# Altium project SMALL_BCMV1.0.PrjPcb (part 3 of 3)

## Sheet DISCRETE_OUT.SchDoc
size A4; SheetNumber: 12; SheetTotal: 13
Used 2 times, as channels U_DISCRETE_OUT1, U_DISCRETE_OUT2. Parts and nets are listed once, with the designators drawn on the sheet.
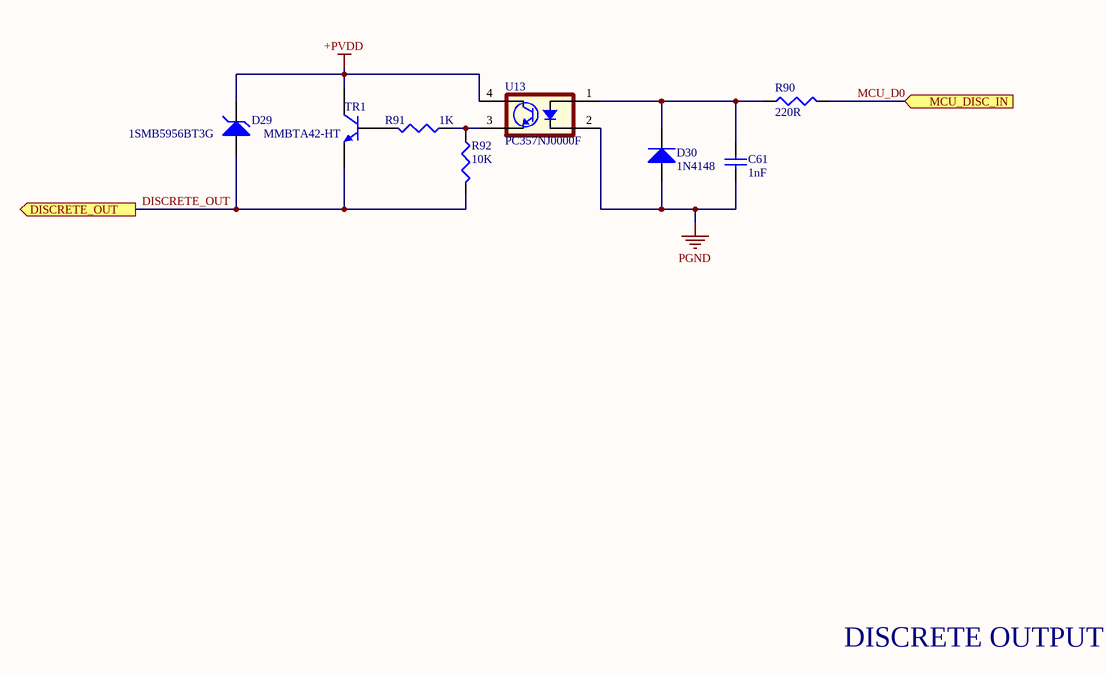
[diagram p16: DISCRETE_OUT.SchDoc]

### Parts
C61  1nF  [C 0603(1608)x0.8_3]
D29  value 1SMB5956BT3G  [DO214AA]  (hidden comment: DIODE 1SMB5956BT3G ZENER 200V 3W DO214AA)
D30  value 1N4148  [SOD123]  (hidden comment: DIODE 1N4148 GEN PURP 100V 150MA SOD123)
R90  220R  [R 0603(1608)]
R91  1K  [R 0603(1608)]
R92  10K  [R 0603(1608)]
TR1  MMBTA42-HT  [SOT23-3]
U13  PC357NJ0000F  [SOIC_1TJ00F_SHP]

### Ports
DISCRETE_OUT (out), MCU_DISC_IN (in)

### Nets
+PVDD: D29.2(K) TR1.3(C) U13.4
PGND: C61.2 D30.1(A) U13.2
DISCRETE_OUT: D29.1(A) R92.2 TR1.2(E) ; port DISCRETE_OUT
MCU_D0: R90.2 ; port MCU_DISC_IN
NetC61_1: C61.1 D30.2(K) R90.1 U13.1
NetR91_1: R91.1 R92.1 U13.3
NetR91_2: R91.2 TR1.1(B)

### Channels
U_DISCRETE_OUT1: designators end in A; ports DISCRETE_OUT=DISCRETE_OUT MCU_DISC_IN=MCU_D0
U_DISCRETE_OUT2: designators end in B; ports DISCRETE_OUT=DISCRETE_OUT MCU_DISC_IN=MCU_D0

### Notes on the sheet
- DISCRETE OUTPUT

### Library data of the parts
C61 = Cap: Cap Ceramic 0.001uF 50V X7R 10% SMD 0603 125C Paper T/R; Manufacturer: Murata; Manufacturer Part Number: GCM188R71H102KA37D; ComponentLink1URL: https://datasheet.ciiva.com/18102/getdatasheetpartid-85307-18102905.pdf?src-supplier=Verical; ComponentLink1Description: https://datasheet.ciiva.com/18102/getdatasheetpartid-85307-18102905.pdf?src-supplier=Verical; ComponentLink2URL: https://datasheet.ciiva.com/129/grm155r71c104ka88-01-129739.pdf?src-supplier=Digi-Key; ComponentLink2Description: https://datasheet.ciiva.com/129/grm155r71c104ka88-01-129739.pdf?src-supplier=Digi-Key; ComponentLink3URL: https://datasheet.ciiva.com/129/grm155r71c104ka88-01-129740.pdf?src-supplier=Digi-Key; ComponentLink3Description: https://datasheet.ciiva.com/129/grm155r71c104ka88-01-129740.pdf?src-supplier=Digi-Key; ComponentLink4URL: https://datasheet.ciiva.com/29199/454098-da-01-en-vs-kondensator-0402-29199799.pdf?src-supplier=Conrad; ComponentLink4Description: https://datasheet.ciiva.com/29199/454098-da-01-en-vs-kondensator-0402-29199799.pdf?src-supplier=Conrad; ComponentLink5URL: https://datasheet.ciiva.com/28534/4360-28534133.pdf?src-supplier=Element14; ComponentLink5Description: https://datasheet.ciiva.com/28534/4360-28534133.pdf?src-supplier=Element14; ComponentLink6URL: https://datasheet.ciiva.com/14103/grmseries-highdielectrictype-eng-14103750.pdf?src-supplier=Distrelec; ComponentLink6Description: https://datasheet.ciiva.com/14103/grmseries-highdielectrictype-eng-14103750.pdf?src-supplier=Distrelec; ComponentLink7URL: https://datasheet.ciiva.com/16199/product-16199000.pdf?src-supplier=Future+Electronics; ComponentLink7Description: https://datasheet.ciiva.com/16199/product-16199000.pdf?src-supplier=Future+Electronics; ComponentLink8URL: https://datasheet.ciiva.com/14116/grmseries-highdielectrictype-eng-14116878.pdf?src-supplier=Distrelec; ComponentLink8Description: https://datasheet.ciiva.com/14116/grmseries-highdielectrictype-eng-14116878.pdf?src-supplier=Distrelec; ComponentLink9URL: https://datasheet.ciiva.com/7937/4360-7937615.pdf?src-supplier=Element14; ComponentLink9Description: https://datasheet.ciiva.com/7937/4360-7937615.pdf?src-supplier=Element14; ComponentLink10URL: https://datasheet.ciiva.com/28534/4360-28534127.pdf?src-supplier=Element14; ComponentLink10Description: https://datasheet.ciiva.com/28534/4360-28534127.pdf?src-supplier=Element14; ComponentLink11URL: http://www.farnell.com/datasheets/2079151.pdf?src-supplier=Farnell; ComponentLink11Description: http://www.farnell.com/datasheets/2079151.pdf?src-supplier=Farnell; ComponentLink12URL: http://www.mouser.com/ds/2/281/c02e-2905.pdf?src-supplier=Mouser; ComponentLink12Description: http://www.mouser.com/ds/2/281/c02e-2905.pdf?src-supplier=Mouser; ComponentLink13URL: http://search.murata.co.jp/Ceramy/image/img/A01X/G101/ENG/GRM155R62A104KE14-01.pdf?src-supplier=Digi-Key; ComponentLink13Description: http://search.murata.co.jp/Ceramy/image/img/A01X/G101/ENG/GRM155R62A104KE14-01.pdf?src-supplier=Digi-Key; ComponentLink14URL: http://www.farnell.com/datasheets/2079151.pdf?src-supplier=Newark; ComponentLink14Description: http://www.farnell.com/datasheets/2079151.pdf?src-supplier=Newark; ComponentLink15URL: http://www.farnell.com/datasheets/2079151.pdf?src-supplier=Element14; ComponentLink15Description: http://www.farnell.com/datasheets/2079151.pdf?src-supplier=Element14; ComponentLink16URL: https://datasheet.ciiva.com/11786/0900766b80d84f1d-11786061.pdf?src-supplier=RSComponents; ComponentLink16Description: https://datasheet.ciiva.com/11786/0900766b80d84f1d-11786061.pdf?src-supplier=RSComponents; ComponentLink17URL: https://datasheet.ciiva.com/144/mlccorderingcode-144176.pdf?src-supplier=Digi-Key; ComponentLink17Description: https://datasheet.ciiva.com/144/mlccorderingcode-144176.pdf?src-supplier=Digi-Key; ComponentLink18URL: https://datasheet.ciiva.com/144/mlccorderingcode-144177.pdf?src-supplier=Digi-Key; ComponentLink18Description: https://datasheet.ciiva.com/144/mlccorderingcode-144177.pdf?src-supplier=Digi-Key; ComponentLink19URL: https://datasheet.ciiva.com/144/mlccorderingcode-144178.pdf?src-supplier=Digi-Key; ComponentLink19Description: https://datasheet.ciiva.com/144/mlccorderingcode-144178.pdf?src-supplier=Digi-Key; ComponentLink20URL: https://datasheet.ciiva.com/7978/1489800-7978166.pdf?src-supplier=Element14; ComponentLink20Description: https://datasheet.ciiva.com/7978/1489800-7978166.pdf?src-supplier=Element14; ComponentLink21URL: https://datasheet.ciiva.com/16625/upy-gphc-x7r-6-3v-to-50v-8-16625530.pdf?src-supplier=Avnet+Europe; ComponentLink21Description: https://datasheet.ciiva.com/16625/upy-gphc-x7r-6-3v-to-50v-8-16625530.pdf?src-supplier=Avnet+Europe; ComponentLink22URL: https://datasheet.ciiva.com/8033/70765-8033819.pdf?src-supplier=Element14; ComponentLink22Description: https://datasheet.ciiva.com/8033/70765-8033819.pdf?src-supplier=Element14; ComponentLink23URL: https://datasheet.ciiva.com/8033/70765-8033821.pdf?src-supplier=Element14; ComponentLink23Description: https://datasheet.ciiva.com/8033/70765-8033821.pdf?src-supplier=Element14; ComponentLink24URL: https://datasheet.ciiva.com/22749/1489800-22749214.pdf?src-supplier=Element14; ComponentLink24Description: https://datasheet.ciiva.com/22749/1489800-22749214.pdf?src-supplier=Element14; ComponentLink25URL: https://datasheet.ciiva.com/31394/1489800-31394927.pdf?src-supplier=Farnell; ComponentLink25Description: https://datasheet.ciiva.com/31394/1489800-31394927.pdf?src-supplier=Farnell; Supplier 1: Digi-Key; Supplier Part Number 1: 490-4777-1-ND; RoHS: Yes; Category: Ceramic Capacitors; Stock 1: 11039468; Pricing 1: 1=0,10000, 10=0,07100, 50=0,03900, 100=0,03180, 500=0,02272, 1000=0,01785 (USD); Mount: Surface Mount; Case/Package: 0603; Case Code (Imperial): 0603; Case Code (Metric): 1608; Min Operating Temperature: -55°C; Max Operating Temperature: 125°C; Capacitance: 1nF; Tolerance: 10%; Dielectric: X7R; Packaging: Tape and Reel; Voltage Rating: 50V; Voltage Rating (DC): 50V; Package Quantity: 4000; Termination: SMD/SMT; Voltage: 50V; Series: GCM; Construction: Flat; Length: 1.6mm; Width: 0.8mm; Height: 0.8mm; Thickness: 0.035inch; Depth: 0.8mm; Ratings: AEC-Q200; Radiation Hardening: No; REACH SVHC: No SVHC; Lead Free: Lead Free; RoHS Compliant: Yes; ComponentLink26URL: https://datasheet.ciiva.com/18183/getdatasheetpartid-310250-18183617.pdf?src-supplier=Verical; ComponentLink26Description: https://datasheet.ciiva.com/18183/getdatasheetpartid-310250-18183617.pdf?src-supplier=Verical; ComponentLink27URL: https://datasheet.ciiva.com/11787/0900766b80ef92d0-11787654.pdf?src-supplier=RSComponents; ComponentLink27Description: https://datasheet.ciiva.com/11787/0900766b80ef92d0-11787654.pdf?src-supplier=RSComponents; ComponentLink28URL: https://datasheet.ciiva.com/131/product-131993.pdf?src-supplier=Digi-Key; ComponentLink28Description: https://datasheet.ciiva.com/131/product-131993.pdf?src-supplier=Digi-Key; ComponentLink29URL: https://datasheet.ciiva.com/131/product-131994.pdf?src-supplier=Digi-Key; ComponentLink29Description: https://datasheet.ciiva.com/131/product-131994.pdf?src-supplier=Digi-Key; ComponentLink30URL: https://datasheet.ciiva.com/131/product-131995.pdf?src-supplier=Digi-Key; ComponentLink30Description: https://datasheet.ciiva.com/131/product-131995.pdf?src-supplier=Digi-Key; ComponentLink31URL: https://datasheet.ciiva.com/11621/product-11621654.pdf?src-supplier=Avnet; ComponentLink31Description: https://datasheet.ciiva.com/11621/product-11621654.pdf?src-supplier=Avnet; ComponentLink32URL: https://datasheet.ciiva.com/16624/product-16624559.pdf?src-supplier=Avnet+Europe; ComponentLink32Description: https://datasheet.ciiva.com/16624/product-16624559.pdf?src-supplier=Avnet+Europe
D29 = DIODE 1SMB5956BT3G ZENER 200V 3W DO214AA: Manufacturer: ON SEMI; Code: 3040095; Family: DIODE; Manufacturer Part Name: 1SMB5956BT3G; Package Reference: DO35; Supplier: Farnell; Supplier No: 2440703
D30 = DIODE 1N4148 GEN PURP 100V 150MA SOD123: Manufacturer: MICRO COMMERCIAL; Manufacturer Part Name: 1N4148W-TP; Code: 3040007; Family: DIODE; Package Reference: SOD123; Supplier: Digikey; Supplier No: 1N4148WTPMSTR-ND
R90 = Res3: THICK FILM RESISTOR, 220 OHM, 100mW, 1%; Product Range:RC Series; Resistance:220ohm; Power Rating:100mW; Resistance Tolerance: 1%; Voltage Rating:50V; Resistor Case Style:0603 [1608 Metric]; Packaging:Cut Tape; MSL:-; No. of Pins:2 ;RoHS Compliant: Yes; Manufacturer: Yageo; Manufacturer Part Number: RC0603FR-07220RL; Temperature Coefficient: 100ppm/°C; Voltage Rating (DC): 50V; ComponentLink1URL: https://datasheet.ciiva.com/11819/0900766b80c66297-11819477.pdf?src-supplier=RSComponents; ComponentLink1Description: https://datasheet.ciiva.com/11819/0900766b80c66297-11819477.pdf?src-supplier=RSComponents; ComponentLink2URL: https://datasheet.ciiva.com/12666/pyu-rc0402-51-rohs-l-6-r-12666741.pdf?src-supplier=Mouser; ComponentLink2Description: https://datasheet.ciiva.com/12666/pyu-rc0402-51-rohs-l-6-r-12666741.pdf?src-supplier=Mouser; ComponentLink3URL: https://datasheet.ciiva.com/17063/pyu-rc0402-51-rohs-l-6-r-17063193.pdf?src-supplier=Future+Electronics; ComponentLink3Description: https://datasheet.ciiva.com/17063/pyu-rc0402-51-rohs-l-6-r-17063193.pdf?src-supplier=Future+Electronics; ComponentLink4URL: https://datasheet.ciiva.com/22747/1018594-22747513.pdf?src-supplier=Element14; ComponentLink4Description: https://datasheet.ciiva.com/22747/1018594-22747513.pdf?src-supplier=Element14; ComponentLink5URL: https://datasheet.ciiva.com/7849/1018594-7849869.pdf?src-supplier=Element14; ComponentLink5Description: https://datasheet.ciiva.com/7849/1018594-7849869.pdf?src-supplier=Element14; ComponentLink6URL: https://datasheet.ciiva.com/7983/1018594-7983502.pdf?src-supplier=Element14; ComponentLink6Description: https://datasheet.ciiva.com/7983/1018594-7983502.pdf?src-supplier=Element14; ComponentLink7URL: https://datasheet.ciiva.com/7849/1018594-7849871.pdf?src-supplier=Element14; ComponentLink7Description: https://datasheet.ciiva.com/7849/1018594-7849871.pdf?src-supplier=Element14; ComponentLink8URL: https://datasheet.ciiva.com/11808/0900766b80c66297-11808195.pdf?src-supplier=RSComponents; ComponentLink8Description: https://datasheet.ciiva.com/11808/0900766b80c66297-11808195.pdf?src-supplier=RSComponents; ComponentLink9URL: https://datasheet.ciiva.com/2452/pyu-rc0402-51-rohs-l-6-2452608.pdf?src-supplier=Digi-Key; ComponentLink9Description: https://datasheet.ciiva.com/2452/pyu-rc0402-51-rohs-l-6-2452608.pdf?src-supplier=Digi-Key; ComponentLink10URL: https://datasheet.ciiva.com/2452/pyu-r-int-thick-7-2452609.pdf?src-supplier=Digi-Key; ComponentLink10Description: https://datasheet.ciiva.com/2452/pyu-r-int-thick-7-2452609.pdf?src-supplier=Digi-Key; ComponentLink11URL: https://datasheet.ciiva.com/2452/pyu-r-int-thick-7-2452610.pdf?src-supplier=Digi-Key; ComponentLink11Description: https://datasheet.ciiva.com/2452/pyu-r-int-thick-7-2452610.pdf?src-supplier=Digi-Key; ComponentLink12URL: https://datasheet.ciiva.com/28386/pyu-rc0402-51-rohs-l-6-28386633.pdf?src-supplier=Avnet+Europe; ComponentLink12Description: https://datasheet.ciiva.com/28386/pyu-rc0402-51-rohs-l-6-28386633.pdf?src-supplier=Avnet+Europe; ComponentLink13URL: https://datasheet.ciiva.com/22747/1018594-22747515.pdf?src-supplier=Element14; ComponentLink13Description: https://datasheet.ciiva.com/22747/1018594-22747515.pdf?src-supplier=Element14; ComponentLink14URL: https://datasheet.ciiva.com/7983/1018594-7983535.pdf?src-supplier=Element14; ComponentLink14Description: https://datasheet.ciiva.com/7983/1018594-7983535.pdf?src-supplier=Element14; ComponentLink15URL: https://datasheet.ciiva.com/8896/pyu-rc0402-51-rohs-l-6-8896201.pdf?src-supplier=Avnet; ComponentLink15Description: https://datasheet.ciiva.com/8896/pyu-rc0402-51-rohs-l-6-8896201.pdf?src-supplier=Avnet; ComponentLink16URL: https://datasheet.ciiva.com/15189/getdatasheetpartid-326379-15189533.pdf?src-supplier=Verical; ComponentLink16Description: https://datasheet.ciiva.com/15189/getdatasheetpartid-326379-15189533.pdf?src-supplier=Verical; Supplier 1: Digi-Key; Supplier Part Number 1: 311-220HRCT-ND; RoHS: Yes; Category: Chip SMD Resistors; Stock 1: 1593316; Pricing 1: 1=0,10000, 10=0,02400, 100=0,00970, 1000=0,00436, 2500=0,00378 (USD); Case/Package: 0603; Number of Pins: 2; Case Code (Imperial): 0603; Case Code (Metric): 1608; Size Code: 0603; Min Operating Temperature: -55°C; Max Operating Temperature: 155°C; Resistance: 220R; Tolerance: 1%; Resistor Type: Thick Film; Packaging: Tape and Reel; Power Rating: 100mW; Voltage Rating: 50V; Package Quantity: 1; Termination: SMD/SMT; Number of Terminations: 2; Max Power Dissipation: 100mW; Features: Moisture Resistant; Series: RC; Construction: Rectangular; Length: 1.6mm; Width: 0.031inch; Height: 0.022inch; Depth: 0.8mm; REACH SVHC: No SVHC; Lead Free: Lead Free; RoHS Compliant: Yes; Military Standard: Not; ComponentLink17URL: https://datasheet.ciiva.com/2453/pyu-r-int-thick-7-2453973.pdf?src-supplier=Digi-Key; ComponentLink17Description: https://datasheet.ciiva.com/2453/pyu-r-int-thick-7-2453973.pdf?src-supplier=Digi-Key; ComponentLink18URL: https://datasheet.ciiva.com/2453/pyu-r-int-thick-7-2453974.pdf?src-supplier=Digi-Key; ComponentLink18Description: https://datasheet.ciiva.com/2453/pyu-r-int-thick-7-2453974.pdf?src-supplier=Digi-Key; ComponentLink19URL: https://datasheet.ciiva.com/2453/pyu-r-int-thick-7-2453975.pdf?src-supplier=Digi-Key; ComponentLink19Description: https://datasheet.ciiva.com/2453/pyu-r-int-thick-7-2453975.pdf?src-supplier=Digi-Key; ComponentLink20URL: https://datasheet.ciiva.com/7746/1738695-7746300.pdf?src-supplier=Element14; ComponentLink20Description: https://datasheet.ciiva.com/7746/1738695-7746300.pdf?src-supplier=Element14; ComponentLink21URL: https://datasheet.ciiva.com/7746/1738695-7746301.pdf?src-supplier=Element14; ComponentLink21Description: https://datasheet.ciiva.com/7746/1738695-7746301.pdf?src-supplier=Element14
R91 = Res3: RES SMD 1K OHM 1% 1/10W 0603; Manufacturer: Yageo; Manufacturer Part Number: RC0603FR-071KL; Resistance: 1kR; Temperature Coefficient: 100ppm/°C; Power Rating: 100mW; Voltage Rating: 50V; ComponentLink1URL: https://datasheet.ciiva.com/11819/0900766b80c66297-11819477.pdf?src-supplier=RSComponents; ComponentLink1Description: https://datasheet.ciiva.com/11819/0900766b80c66297-11819477.pdf?src-supplier=RSComponents; ComponentLink2URL: https://datasheet.ciiva.com/12666/pyu-rc0402-51-rohs-l-6-r-12666741.pdf?src-supplier=Mouser; ComponentLink2Description: https://datasheet.ciiva.com/12666/pyu-rc0402-51-rohs-l-6-r-12666741.pdf?src-supplier=Mouser; ComponentLink3URL: https://datasheet.ciiva.com/17063/pyu-rc0402-51-rohs-l-6-r-17063193.pdf?src-supplier=Future+Electronics; ComponentLink3Description: https://datasheet.ciiva.com/17063/pyu-rc0402-51-rohs-l-6-r-17063193.pdf?src-supplier=Future+Electronics; ComponentLink4URL: https://datasheet.ciiva.com/22747/1018594-22747513.pdf?src-supplier=Element14; ComponentLink4Description: https://datasheet.ciiva.com/22747/1018594-22747513.pdf?src-supplier=Element14; ComponentLink5URL: https://datasheet.ciiva.com/7849/1018594-7849869.pdf?src-supplier=Element14; ComponentLink5Description: https://datasheet.ciiva.com/7849/1018594-7849869.pdf?src-supplier=Element14; ComponentLink6URL: https://datasheet.ciiva.com/7983/1018594-7983502.pdf?src-supplier=Element14; ComponentLink6Description: https://datasheet.ciiva.com/7983/1018594-7983502.pdf?src-supplier=Element14; ComponentLink7URL: https://datasheet.ciiva.com/7849/1018594-7849871.pdf?src-supplier=Element14; ComponentLink7Description: https://datasheet.ciiva.com/7849/1018594-7849871.pdf?src-supplier=Element14; ComponentLink8URL: https://datasheet.ciiva.com/11808/0900766b80c66297-11808195.pdf?src-supplier=RSComponents; ComponentLink8Description: https://datasheet.ciiva.com/11808/0900766b80c66297-11808195.pdf?src-supplier=RSComponents; ComponentLink9URL: https://datasheet.ciiva.com/2452/pyu-rc0402-51-rohs-l-6-2452608.pdf?src-supplier=Digi-Key; ComponentLink9Description: https://datasheet.ciiva.com/2452/pyu-rc0402-51-rohs-l-6-2452608.pdf?src-supplier=Digi-Key; ComponentLink10URL: https://datasheet.ciiva.com/2452/pyu-r-int-thick-7-2452609.pdf?src-supplier=Digi-Key; ComponentLink10Description: https://datasheet.ciiva.com/2452/pyu-r-int-thick-7-2452609.pdf?src-supplier=Digi-Key; ComponentLink11URL: https://datasheet.ciiva.com/2452/pyu-r-int-thick-7-2452610.pdf?src-supplier=Digi-Key; ComponentLink11Description: https://datasheet.ciiva.com/2452/pyu-r-int-thick-7-2452610.pdf?src-supplier=Digi-Key; ComponentLink12URL: https://datasheet.ciiva.com/28386/pyu-rc0402-51-rohs-l-6-28386633.pdf?src-supplier=Avnet+Europe; ComponentLink12Description: https://datasheet.ciiva.com/28386/pyu-rc0402-51-rohs-l-6-28386633.pdf?src-supplier=Avnet+Europe; ComponentLink13URL: https://datasheet.ciiva.com/22747/1018594-22747515.pdf?src-supplier=Element14; ComponentLink13Description: https://datasheet.ciiva.com/22747/1018594-22747515.pdf?src-supplier=Element14; ComponentLink14URL: https://datasheet.ciiva.com/7983/1018594-7983535.pdf?src-supplier=Element14; ComponentLink14Description: https://datasheet.ciiva.com/7983/1018594-7983535.pdf?src-supplier=Element14; ComponentLink15URL: https://datasheet.ciiva.com/8896/pyu-rc0402-51-rohs-l-6-8896201.pdf?src-supplier=Avnet; ComponentLink15Description: https://datasheet.ciiva.com/8896/pyu-rc0402-51-rohs-l-6-8896201.pdf?src-supplier=Avnet; ComponentLink16URL: https://datasheet.ciiva.com/15189/getdatasheetpartid-326379-15189533.pdf?src-supplier=Verical; ComponentLink16Description: https://datasheet.ciiva.com/15189/getdatasheetpartid-326379-15189533.pdf?src-supplier=Verical; Supplier 1: Digi-Key; Supplier Part Number 1: 311-1.00KHRCT-ND; RoHS: Yes; Category: Chip SMD Resistors; Stock 1: 11977983; Pricing 1: 1=0,10000, 10=0,02400, 100=0,00970, 1000=0,00436, 2500=0,00378 (USD); Case/Package: 0603; Contact Plating: Tin,Matte; Case Code (Imperial): 0603; Case Code (Metric): 1608; Size Code: 0603; Min Operating Temperature: -55°C; Max Operating Temperature: 155°C; Tolerance: 1%; Resistor Type: Thick Film; Packaging: Tape and Reel; Termination: SMD/SMT; Features: Moisture Resistant; Series: RC; Max Power Dissipation: 100mW; Number of Terminations: 2; Technology: THICK FILM; Resistance Tolerance: 1%; Construction: Rectangular; Length: 1.6mm; Height: 0.45mm; Depth: 0.8mm; Radiation Hardening: No; REACH SVHC: No SVHC; Lead Free: Lead Free; Military Standard: Not; RoHS Compliant: Yes
R92 = Res3: Res General Purpose Thick Film 0603 10K Ohm 1% 1/10W ±100ppm/°C Molded SMD Paper T/R; Manufacturer: Yageo; Manufacturer Part Number: RC0603FR-0710KL; Resistance: 10kR; Voltage Rating (DC): 50V; Power Rating: 100mW; Voltage Rating: 75V; ComponentLink1URL: https://datasheet.ciiva.com/11819/0900766b80c66297-11819477.pdf?src-supplier=RSComponents; ComponentLink1Description: https://datasheet.ciiva.com/11819/0900766b80c66297-11819477.pdf?src-supplier=RSComponents; ComponentLink2URL: https://datasheet.ciiva.com/12666/pyu-rc0402-51-rohs-l-6-r-12666741.pdf?src-supplier=Mouser; ComponentLink2Description: https://datasheet.ciiva.com/12666/pyu-rc0402-51-rohs-l-6-r-12666741.pdf?src-supplier=Mouser; ComponentLink3URL: https://datasheet.ciiva.com/17063/pyu-rc0402-51-rohs-l-6-r-17063193.pdf?src-supplier=Future+Electronics; ComponentLink3Description: https://datasheet.ciiva.com/17063/pyu-rc0402-51-rohs-l-6-r-17063193.pdf?src-supplier=Future+Electronics; ComponentLink4URL: https://datasheet.ciiva.com/22747/1018594-22747513.pdf?src-supplier=Element14; ComponentLink4Description: https://datasheet.ciiva.com/22747/1018594-22747513.pdf?src-supplier=Element14; ComponentLink5URL: https://datasheet.ciiva.com/7849/1018594-7849869.pdf?src-supplier=Element14; ComponentLink5Description: https://datasheet.ciiva.com/7849/1018594-7849869.pdf?src-supplier=Element14; ComponentLink6URL: https://datasheet.ciiva.com/7983/1018594-7983502.pdf?src-supplier=Element14; ComponentLink6Description: https://datasheet.ciiva.com/7983/1018594-7983502.pdf?src-supplier=Element14; ComponentLink7URL: https://datasheet.ciiva.com/7849/1018594-7849871.pdf?src-supplier=Element14; ComponentLink7Description: https://datasheet.ciiva.com/7849/1018594-7849871.pdf?src-supplier=Element14; ComponentLink8URL: https://datasheet.ciiva.com/11808/0900766b80c66297-11808195.pdf?src-supplier=RSComponents; ComponentLink8Description: https://datasheet.ciiva.com/11808/0900766b80c66297-11808195.pdf?src-supplier=RSComponents; ComponentLink9URL: https://datasheet.ciiva.com/2452/pyu-rc0402-51-rohs-l-6-2452608.pdf?src-supplier=Digi-Key; ComponentLink9Description: https://datasheet.ciiva.com/2452/pyu-rc0402-51-rohs-l-6-2452608.pdf?src-supplier=Digi-Key; ComponentLink10URL: https://datasheet.ciiva.com/2452/pyu-r-int-thick-7-2452609.pdf?src-supplier=Digi-Key; ComponentLink10Description: https://datasheet.ciiva.com/2452/pyu-r-int-thick-7-2452609.pdf?src-supplier=Digi-Key; ComponentLink11URL: https://datasheet.ciiva.com/2452/pyu-r-int-thick-7-2452610.pdf?src-supplier=Digi-Key; ComponentLink11Description: https://datasheet.ciiva.com/2452/pyu-r-int-thick-7-2452610.pdf?src-supplier=Digi-Key; ComponentLink12URL: https://datasheet.ciiva.com/28386/pyu-rc0402-51-rohs-l-6-28386633.pdf?src-supplier=Avnet+Europe; ComponentLink12Description: https://datasheet.ciiva.com/28386/pyu-rc0402-51-rohs-l-6-28386633.pdf?src-supplier=Avnet+Europe; ComponentLink13URL: https://datasheet.ciiva.com/22747/1018594-22747515.pdf?src-supplier=Element14; ComponentLink13Description: https://datasheet.ciiva.com/22747/1018594-22747515.pdf?src-supplier=Element14; ComponentLink14URL: https://datasheet.ciiva.com/7983/1018594-7983535.pdf?src-supplier=Element14; ComponentLink14Description: https://datasheet.ciiva.com/7983/1018594-7983535.pdf?src-supplier=Element14; ComponentLink15URL: https://datasheet.ciiva.com/8896/pyu-rc0402-51-rohs-l-6-8896201.pdf?src-supplier=Avnet; ComponentLink15Description: https://datasheet.ciiva.com/8896/pyu-rc0402-51-rohs-l-6-8896201.pdf?src-supplier=Avnet; ComponentLink16URL: https://datasheet.ciiva.com/15189/getdatasheetpartid-326379-15189533.pdf?src-supplier=Verical; ComponentLink16Description: https://datasheet.ciiva.com/15189/getdatasheetpartid-326379-15189533.pdf?src-supplier=Verical; Supplier 1: Digi-Key; Supplier Part Number 1: 311-10.0KHRCT-ND; RoHS: Yes; Category: Chip SMD Resistors; Stock 1: 16075853; Pricing 1: 1=0,10000, 10=0,02400, 100=0,00970, 1000=0,00436, 2500=0,00378 (USD); Case/Package: 0603; Number of Pins: 2; Case Code (Imperial): 0603; Case Code (Metric): 1608; Weight: 7.1E-05oz; Size Code: 0603; Min Operating Temperature: -55°C; Max Operating Temperature: 155°C; Tolerance: 1%; Resistor Type: Thick Film; Temperature Coefficient: 100ppm/°C; Packaging: Tape and Reel; Termination: SMD/SMT; Features: Moisture Resistant; Series: RC; Max Power Dissipation: 100mW; Number of Terminations: 2; Resistance Tolerance: 1%; Construction: Rectangular; Length: 1.6mm; Width: 0.8mm; Height: 0.45mm; Depth: 0.8mm; Lead Pitch: 0.3mm; REACH SVHC: Unknown; Lead Free: Lead Free; Military Standard: Not; RoHS Compliant: Yes; ComponentLink17URL: https://datasheet.ciiva.com/7660/38590-7660789.pdf?src-supplier=Element14; ComponentLink17Description: https://datasheet.ciiva.com/7660/38590-7660789.pdf?src-supplier=Element14; ComponentLink18URL: https://datasheet.ciiva.com/7983/443971-7983596.pdf?src-supplier=Element14; ComponentLink18Description: https://datasheet.ciiva.com/7983/443971-7983596.pdf?src-supplier=Element14; ComponentLink19URL: https://datasheet.ciiva.com/22747/443971-22747519.pdf?src-supplier=Element14; ComponentLink19Description: https://datasheet.ciiva.com/22747/443971-22747519.pdf?src-supplier=Element14; ComponentLink20URL: https://datasheet.ciiva.com/46440/1868787-46440891.pdf?src-supplier=Element14; ComponentLink20Description: https://datasheet.ciiva.com/46440/1868787-46440891.pdf?src-supplier=Element14; ComponentLink21URL: https://datasheet.ciiva.com/7746/1738695-7746239.pdf?src-supplier=Element14; ComponentLink21Description: https://datasheet.ciiva.com/7746/1738695-7746239.pdf?src-supplier=Element14; ComponentLink22URL: https://datasheet.ciiva.com/15189/getdatasheetpartid-409289-15189591.pdf?src-supplier=Verical; ComponentLink22Description: https://datasheet.ciiva.com/15189/getdatasheetpartid-409289-15189591.pdf?src-supplier=Verical
TR1 = MMBTA42-HT: TRANS MMBTA42-HT BIPOLAR TRANSISTOR NPN SOT23; Manufacturer: HOTTECH; Code: 3040094; Family: TRANS; Manufacturer Part Name: MMBTA42-HT; Package Reference: SOT23-3; Supplier: Ozdisan; Supplier No: MMBTA42-HT; Value: MMBTA42-HT
U13 = PC357NJ0000F: Manufacturer: Socle Technology; Supplier 1: Digi-Key; Manufacturer Part Number: PC357NJ0000F; RoHS: No; Stock 1: 22388; Pricing 1: 1=0,83000, 10=0,53800, 100=0,35270, 1000=0,27841 (USD); Supplier Part Number 1: 1855-1023-1-ND

## Sheet CAN.SchDoc
size A3; SheetNumber: 8; SheetTotal: 13
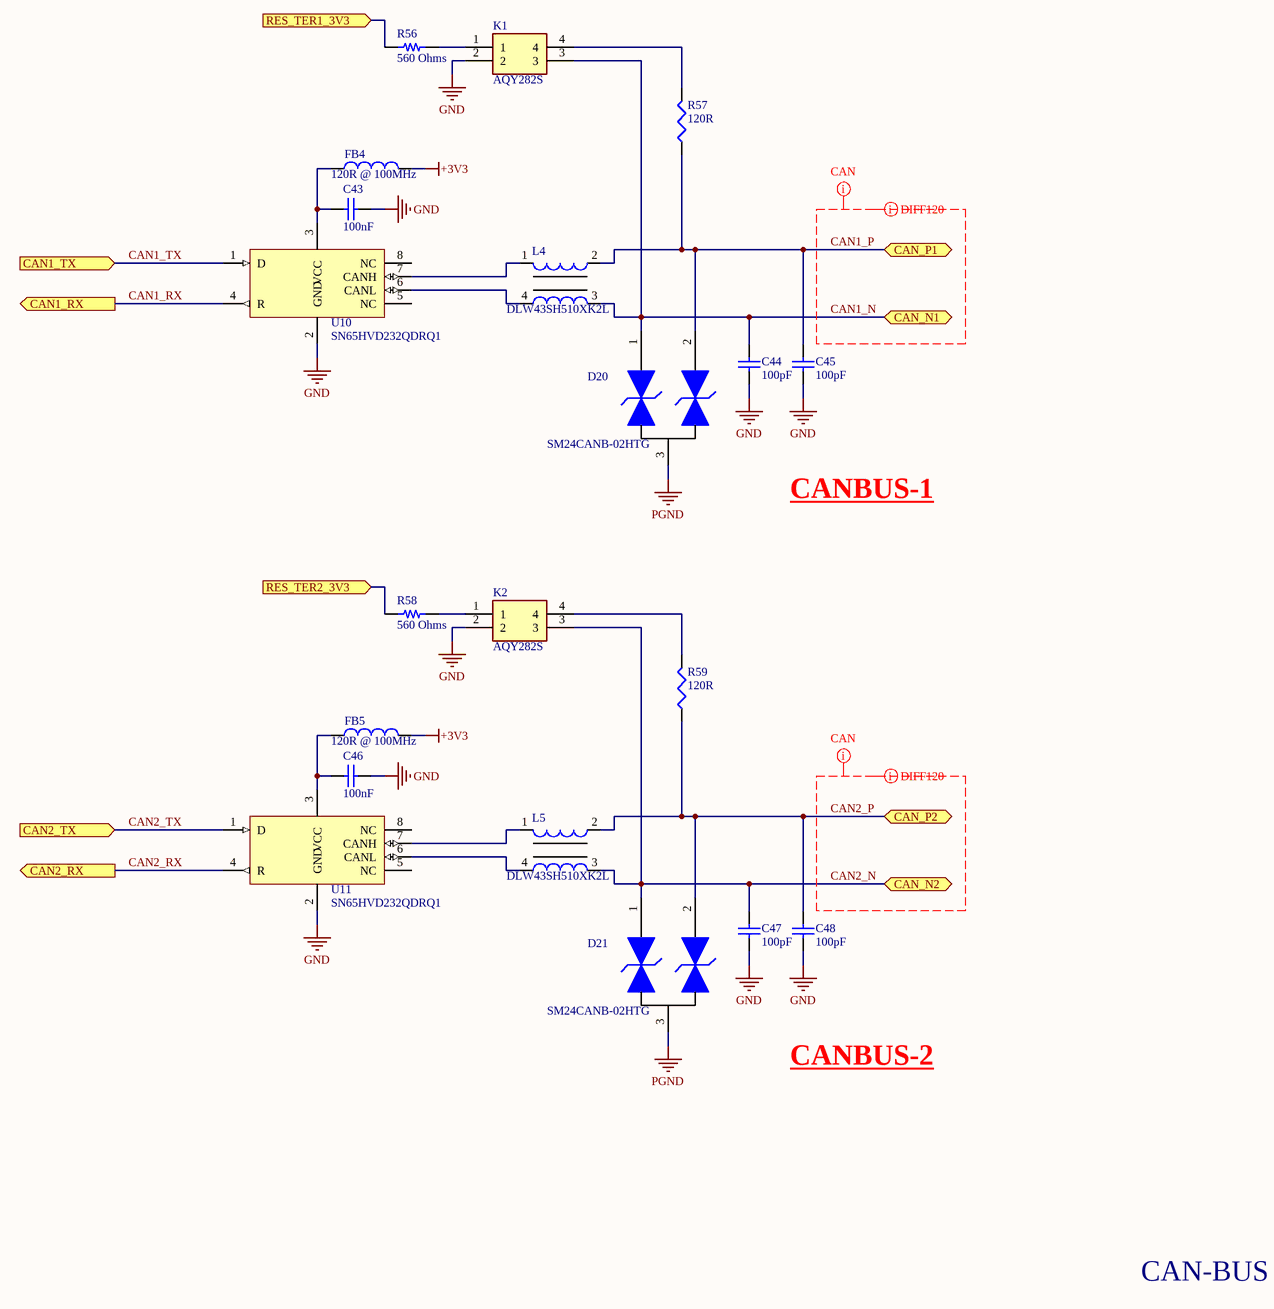
[diagram p17: CAN.SchDoc]

### Parts
C43  100nF  [CAP0603]
C44  100pF  [CAP0603]
C45  100pF  [CAP0603]
C46  100nF  [CAP0603]
C47  100pF  [CAP0603]
C48  100pF  [CAP0603]
D20  P/N: SM24CANB-02HTG  [SOT23_3-DIODE]  (hidden comment: CAN)
D21  P/N: SM24CANB-02HTG  [SOT23_3-DIODE]  (hidden comment: CAN)
FB4  120R @ 100MHz  [FB0603]
FB5  120R @ 100MHz  [FB0603]
K1  AQY282S  [SOP254P680X230-4N]
K2  AQY282S  [SOP254P680X230-4N]
L4  P/N: DLW43SH510XK2L  [CMC_DLW43SH510XK2L]  (hidden comment: CMC_DLW43SH510XK2L)
L5  P/N: DLW43SH510XK2L  [CMC_DLW43SH510XK2L]  (hidden comment: CMC_DLW43SH510XK2L)
R56  560 Ohms  [RES 0603_1608]
R57  120R  [RES0603]
R58  560 Ohms  [RES 0603_1608]
R59  120R  [RES0603]
U10  P/N: SN65HVD232QDRQ1  [SOIC8]  (hidden comment: CAN)
U11  P/N: SN65HVD232QDRQ1  [SOIC8]  (hidden comment: CAN)

### Ports
CAN1_RX (out), CAN1_TX (in), CAN2_RX (out), CAN2_TX (in), CAN_N1 (bidir), CAN_N2 (bidir), CAN_P1 (bidir), CAN_P2 (bidir), RES_TER1_3V3 (in), RES_TER2_3V3 (in)

### Nets
+3V3: FB4.2 FB5.2
GND: C43.2 C44.1 C45.1 C46.2 C47.1 C48.1 K1.2 K2.2 U10.2(GND) U11.2(GND)
PGND: D20.3 D21.3
CAN1_N: C44.2 D20.1 K1.3 L4.3 ; port CAN_N1
CAN1_P: C45.2 D20.2 L4.2 R57.1 ; port CAN_P1
CAN1_RX: U10.4(R) ; port CAN1_RX
CAN1_TX: U10.1(D) ; port CAN1_TX
CAN2_N: C47.2 D21.1 K2.3 L5.3 ; port CAN_N2
CAN2_P: C48.2 D21.2 L5.2 R59.1 ; port CAN_P2
CAN2_RX: U11.4(R) ; port CAN2_RX
CAN2_TX: U11.1(D) ; port CAN2_TX
RES_TER1_3V3: R56.1 ; port RES_TER1_3V3
RES_TER2_3V3: R58.1 ; port RES_TER2_3V3
NetC43_1: C43.1 FB4.1 U10.3(VCC)
NetC46_1: C46.1 FB5.1 U11.3(VCC)
NetK1_1: K1.1 R56.2
NetK1_4: K1.4 R57.2
NetK2_1: K2.1 R58.2
NetK2_4: K2.4 R59.2
NetL4_1: L4.1 U10.7(CANH)
NetL4_4: L4.4 U10.6(CANL)
NetL5_1: L5.1 U11.7(CANH)
NetL5_4: L5.4 U11.6(CANL)

Not connected (* = marked no-connect by the designer): U10 5(NC) 8(NC); U11 5(NC) 8(NC)

### Layout directives
net class CAN1: CAN1_N, CAN1_P
differential pair: CAN1_N, CAN1_P, CAN2_N, CAN2_P
net class CAN2: CAN2_N, CAN2_P

### Notes on the sheet
- CANBUS-1
- CANBUS-2
- CAN-BUS

### Library data of the parts
C43 C46 = CAP0603_100nF: CAP CER 0.1UF 50V X7R 0603; P/N: C0603C104K5RACTU; Value: 100nF 50V; Order Code: DIGI : 399-5089-1-ND
C44 C45 C47 C48 = CAP0603_100pF: CAP CER 100PF 50V C0G/NP0 0603; P/N: C0603C101J5GACTU; Order Code: DIGI : 399-1061-1-ND; Value: 100pF 50V
D20 D21 = SM24CANB-02HTG_TVS: TVS DIODE 24VWM 50VC SOT23-3; Order Code: DIGI : F6707CT-ND; Value: 2Ch
FB4 FB5 = FB0603_120R@100MHz: FERRITE BEAD 120 OHM 0603 1LN; P/N: BLM18KG121TH1D; Order Code: DIGI : 490-13261-1-ND; Value: 120R @ 100MHz
K1 K2 = AQY282S: Relay or Contactor; Manufacturer_Name: Panasonic; Datasheet Link: https://datasheet.lcsc.com/szlcsc/PANASONIC-AQY282S_C129284.pdf; Height: 2.3mm; Manufacturer_Part_Number: AQY282S; Mouser Part Number: 769-AQY282S; Mouser Price/Stock: https://www.mouser.co.uk/ProductDetail/Panasonic-Industrial-Devices/AQY282S?qs=sEN%2FkO1EG6bFR4N8wKfhAA%3D%3D; Arrow Part Number: AQY282S; Arrow Price/Stock: https://www.arrow.com/en/products/aqy282s/panasonic?region=nac
L4 L5 = CMC_DLW43SH510XK2L: CMC 51UH 230MA 2LN SMD AEC-Q200; Order Code: DIGI : 490-7982-1-ND; Value: 51uH
R56 R58 = RMCF0603JT560R: RES 560 OHM 5% 1/10W 0603; Manufacturer: Stackpole Electronics Inc; Power (Watts): 0.1W, 1/10W; Temperature Coefficient: ±200ppm/°C; Part Number: RMCF0603JT560R; Value: 560 Ohms; ComponentLink1Description: Datasheet; ComponentLink1URL: https://www.seielect.com/catalog/sei-rmcf_rmcp.pdf; ComponentLink2Description: DigiKey Link; ComponentLink2URL: https://www.digikey.com/en/products/detail/stackpole-electronics-inc/RMCF0603JT560R/1712305; Composition: Thick Film; Device Package: 0603 (1608 Metric); Features: Automotive AEC-Q200; Height - Seated (Max): 0.022" (0.55mm); LastUpdated: 22.06.2022 13:19:51; Lifecycle Status: Active; Minimum Order: 1; Number of Terminations: 2; Operating Temperature: -55°C ~ 155°C; Package / Case: 0603 (1608 Metric); Packaging: CutTape; PartId: 5967; Part Status: Active; Price: 0.01; Ratings: AEC-Q200; Resistance: 560 Ohms; Series: RMCF; Size / Dimension: 0.061" L x 0.031" W (1.55mm x 0.80mm); Supplier 1: DigiKey; Supplier Part Number 1: RMCF0603JT560RCT-ND; Supplier Device Package: 0603; Tolerance: ±5%
R57 R59 = RES0603_120R: RES SMD 120 OHM 1% 1/10W 0603; Order Code: DIGI : 311-120HRCT-ND; P/N: RC0603FR-07120RL; ART Code: ART0023420; Value: 120R
U10 U11 = SN65HVD232QDRQ1_CAN: IC TRANSCEIVER HALF 1/1 8SOIC; Order Code: DIGI : 296-15381-1-ND; Value: CAN

## Nets that join several sheets
+3V3: INPUT_PROTECTION (R70.2), Voltage_conversion (10 pins), Controller (15 pins), DISCRETE_INPUT (IC1.6 IC1.8), ANALOG_MUX (FB1.1 FB2.1 FB3.1), CAN (FB4.2 FB5.2)
+PVDD: U_F_BRIDGE1 (8 pins), U_F_BRIDGE2 (8 pins), U_H_BRIDGE1 (C35A.2 C36A.2 C37A.1 U8A.7), U_H_BRIDGE2 (C35B.2 C36B.2 C37B.1 U8B.7), U_HS_SW1 (C40A.2 C41A.1 U9A.6), U_HS_SW2 (C40B.2 C41B.1 U9B.6), U_HS_SW3 (C40C.2 C41C.1 U9C.6), U_HS_SW4 (C40D.2 C41D.1 U9D.6), U_HS_SW5 (C40E.2 C41E.1 U9E.6), U_HS_SW6 (C40F.2 C41F.1 U9F.6), INPUT_PROTECTION (8 pins), Voltage_conversion (C2.2 L1.1), U_DISCRETE_OUT1 (D29A.2 TR1A.3 U13A.4), U_DISCRETE_OUT2 (D29B.2 TR1B.3 U13B.4)
GND: USB (B1.1), Controller (52 pins), ANALOG_MUX (12 pins), CAN (10 pins)
PGND: SMALL_BCM (6 pins), U_F_BRIDGE1 (20 pins), U_F_BRIDGE2 (20 pins), U_H_BRIDGE1 (10 pins), U_H_BRIDGE2 (10 pins), U_HS_SW1 (11 pins), U_HS_SW2 (11 pins), U_HS_SW3 (11 pins), U_HS_SW4 (11 pins), U_HS_SW5 (11 pins), U_HS_SW6 (11 pins), INPUT_PROTECTION (14 pins), Voltage_conversion (37 pins), Controller (D32.2 FB8.1 R99.1), DISCRETE_INPUT (R78.1 R80.1 R87.1 R88.1), U_DISCRETE_OUT1 (C61A.2 D30A.1 U13A.2), U_DISCRETE_OUT2 (C61B.2 D30B.1 U13B.2), CAN (D20.3 D21.3)
VIN: SMALL_BCM (8 pins), INPUT_PROTECTION (6 pins)
12V_SNS: Voltage_conversion (D3.1 R3.1 R9.2 TP3.1), Controller (U14.44)
AN_MUX1: Controller (R93.2), ANALOG_MUX (TP5.1 U3.3)
AN_MUX2: Controller (R94.2), ANALOG_MUX (TP6.1 U5.3)
AN_MUX3: Controller (R95.2), ANALOG_MUX (TP7.1 U4.3)
CAN1_N: SMALL_BCM (J3.2), CAN (C44.2 D20.1 K1.3 L4.3)
CAN1_P: SMALL_BCM (J3.1), CAN (C45.2 D20.2 L4.2 R57.1)
CAN1_RX: Controller (U14.114), CAN (U10.4)
CAN1_TX: Controller (U14.115), CAN (U10.1)
CAN2_N: SMALL_BCM (J3.7), CAN (C47.2 D21.1 K2.3 L5.3)
CAN2_P: SMALL_BCM (J3.8), CAN (C48.2 D21.2 L5.2 R59.1)
CAN2_RX: Controller (U14.135), CAN (U11.4)
CAN2_TX: Controller (U14.136), CAN (U11.1)
DISCRETE_INA: SMALL_BCM (J4.3), DISCRETE_INPUT (R74.1)
DISCRETE_INB: SMALL_BCM (J4.6), DISCRETE_INPUT (R82.1)
DISCRETE_OUT: SMALL_BCM (J2.6), U_DISCRETE_OUT1 (D29A.1 R92A.2 TR1A.2)
DISCRETE_OUT: SMALL_BCM (J2.9), U_DISCRETE_OUT2 (D29B.1 R92B.2 TR1B.2)
EN_12V: Voltage_conversion (R10.2), Controller (U14.65)
FBL_IN1: U_F_BRIDGE1 (R25A.1), Controller (U14.60)
FBL_IN2: U_F_BRIDGE2 (R25B.1), Controller (U14.66)
FBL_INH1: U_F_BRIDGE1 (R26A.1), Controller (U14.53)
FBL_INH2: U_F_BRIDGE2 (R26B.1), Controller (U14.54)
FBL_OL1: U_F_BRIDGE1 (R24A.2), Controller (U14.55)
FBL_OL2: U_F_BRIDGE2 (R24B.2), Controller (U14.58)
FBL_OUT1: SMALL_BCM (J2.8), U_F_BRIDGE1 (6 pins)
FBL_OUT2: SMALL_BCM (J2.7), U_F_BRIDGE2 (6 pins)
FBR_IN1: U_F_BRIDGE1 (R33A.1), Controller (U14.64)
FBR_IN2: U_F_BRIDGE2 (R33B.1), Controller (U14.67)
FBR_INH1: U_F_BRIDGE1 (R34A.1), Controller (U14.57)
FBR_INH2: U_F_BRIDGE2 (R34B.1), Controller (U14.56)
FBR_OL1: U_F_BRIDGE1 (R32A.2), Controller (U14.59)
FBR_OL2: U_F_BRIDGE2 (R32B.2), Controller (U14.63)
FBR_OUT1: SMALL_BCM (J2.5), U_F_BRIDGE1 (6 pins)
FBR_OUT2: SMALL_BCM (J2.4), U_F_BRIDGE2 (6 pins)
HB_IN1: U_H_BRIDGE1 (R41A.1), Controller (U14.4)
HB_IN2: U_H_BRIDGE2 (R41B.1), Controller (U14.5)
HB_INH1: U_H_BRIDGE1 (R42A.1), Controller (U14.142)
HB_INH2: U_H_BRIDGE2 (R42B.1), Controller (U14.1)
HB_OL1: U_H_BRIDGE1 (R40A.2), Controller (U14.2)
HB_OL2: U_H_BRIDGE2 (R40B.2), Controller (U14.3)
HB_OUT1: SMALL_BCM (J2.3), U_H_BRIDGE1 (6 pins)
HB_OUT2: SMALL_BCM (J2.2), U_H_BRIDGE2 (6 pins)
MCU_D0: Controller (U14.129), U_DISCRETE_OUT2 (R90B.2)
MCU_D0: Controller (U14.132), U_DISCRETE_OUT1 (R90A.2)
MCU_INA: Controller (R96.1), DISCRETE_INPUT (R77.2 R80.2)
MCU_INB: Controller (R97.1), DISCRETE_INPUT (R84.2 R87.2)
P_OUT1: SMALL_BCM (J4.1), U_HS_SW1 (8 pins)
P_OUT2: SMALL_BCM (J4.4), U_HS_SW2 (8 pins)
P_OUT3: SMALL_BCM (J4.7), U_HS_SW3 (8 pins)
P_OUT4: SMALL_BCM (J4.2), U_HS_SW4 (8 pins)
P_OUT5: SMALL_BCM (J4.5), U_HS_SW5 (8 pins)
P_OUT6: SMALL_BCM (J4.8), U_HS_SW6 (8 pins)
P_OUT_C1: U_HS_SW1 (R52A.2), Controller (U14.34)
P_OUT_C2: U_HS_SW2 (R52B.2), Controller (U14.35)
P_OUT_C3: U_HS_SW3 (R52C.2), Controller (U14.36)
P_OUT_C4: U_HS_SW4 (R52D.2), Controller (U14.37)
P_OUT_C5: U_HS_SW5 (R52E.2), Controller (U14.41)
P_OUT_C6: U_HS_SW6 (R52F.2), Controller (U14.42)
P_OUT_OL1: U_HS_SW1 (R48A.2), Controller (U14.93)
P_OUT_OL2: U_HS_SW2 (R48B.2), Controller (U14.92)
P_OUT_OL3: U_HS_SW3 (R48C.2), Controller (U14.91)
P_OUT_OL4: U_HS_SW4 (R48D.2), Controller (U14.90)
P_OUT_OL5: U_HS_SW5 (R48E.2), Controller (U14.89)
P_OUT_OL6: U_HS_SW6 (R48F.2), Controller (U14.88)
PDG_12V: Voltage_conversion (R12.2 U1.6), Controller (U14.46)
PGD_3V3: Voltage_conversion (R20.2 U2.6), Controller (U14.43)
PRT_FLT: INPUT_PROTECTION (D26.2 TP19.1 U12.7), Controller (U14.40)
PVDD_SNS: INPUT_PROTECTION (D25.1 R65.1 R68.2 TP16.1), Controller (U14.45)
RES_TER1_3V3: Controller (U14.8), CAN (R56.1)
RES_TER2_3V3: Controller (U14.7), CAN (R58.1)
S0: Controller (U14.79), ANALOG_MUX (TP8.1 U3.11 U4.11 U5.11)
S1: Controller (U14.80), ANALOG_MUX (TP9.1 U3.10 U4.10 U5.10)
S2: Controller (U14.81), ANALOG_MUX (TP10.1 U3.9 U4.9 U5.9)
TACHO: SMALL_BCM (J4.9), Controller (D31.1)
USB_D_N: USB (C49.2 R60.1), Controller (U14.103)
USB_D_P: USB (C50.2 R61.1 R62.1), Controller (U14.104)

## Assembly variants
Variant of SMALL_BCMV1.0: not fitted R49 R50 R55